# Altium schematic sheet Connector.SchDoc
size A3; SheetNumber: 1; SheetTotal: 6
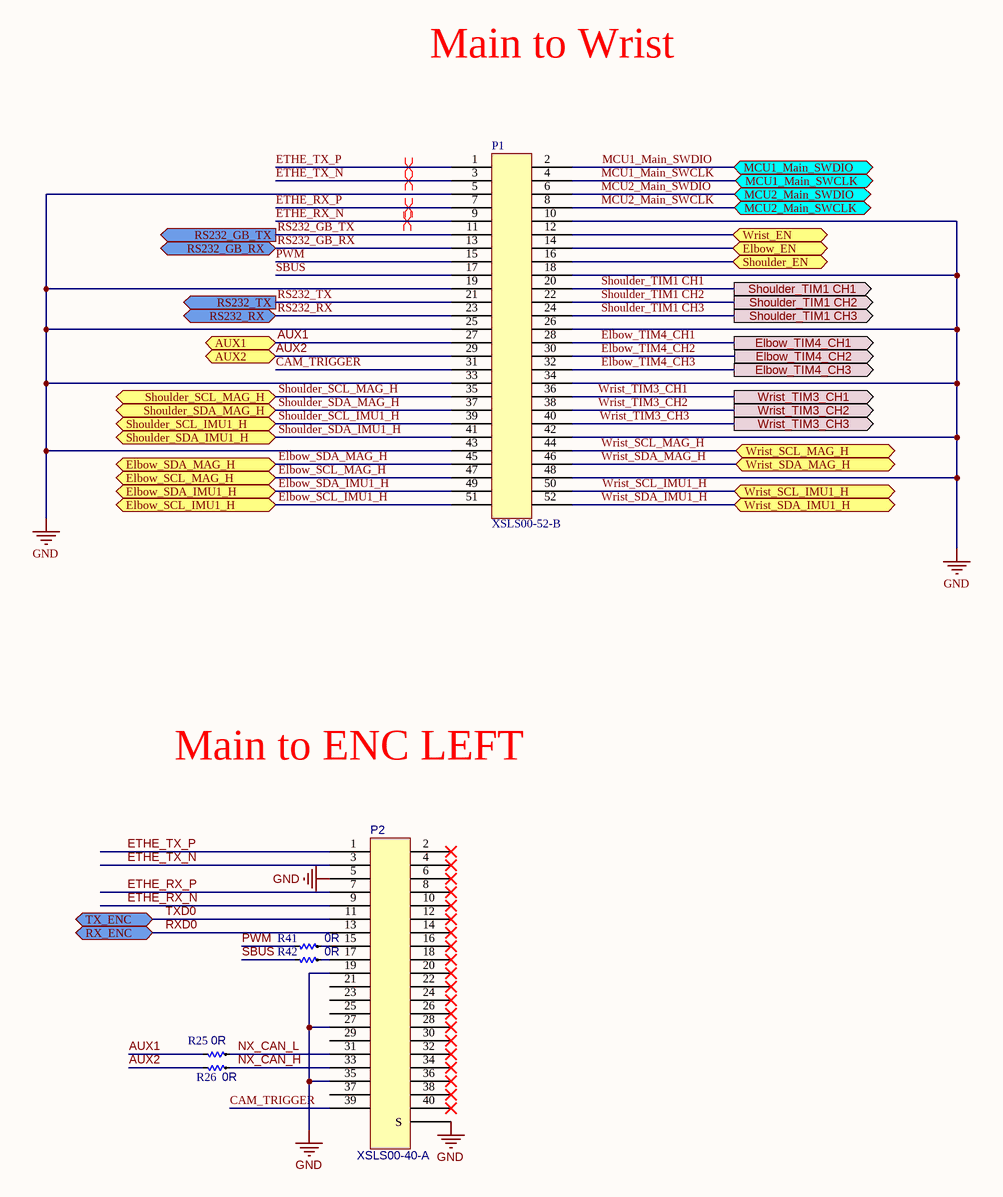
[diagram p0: Connector.SchDoc]

## Parts
P1  XSLS00-52-B  [XSXL52]
P2  XSLS00-40-A  [XSXL40]
R25  value 0R  [RES0402]  (hidden comment: RES0402 0R)  (no BOM)
R26  value 0R  [RES0402]  (hidden comment: RES0402 0R)  (no BOM)
R41  value 0R  [RES0402]  (hidden comment: RES0402 0R)
R42  value 0R  [RES0402]  (hidden comment: RES0402 0R)

## Ports
AUX1 (bidir), AUX2 (bidir), Elbow_EN (bidir), Elbow_SCL_IMU1_H (bidir), Elbow_SCL_MAG_H (bidir), Elbow_SDA_IMU1_H (bidir), Elbow_SDA_MAG_H (bidir), Elbow_TIM4_CH1 (out), Elbow_TIM4_CH2 (out), Elbow_TIM4_CH3 (out), MCU1_Main_SWCLK (bidir), MCU1_Main_SWDIO (bidir), MCU2_Main_SWCLK (bidir), MCU2_Main_SWDIO (bidir), RS232_GB_RX (bidir), RS232_GB_TX (out), RS232_RX (bidir), RS232_TX (out), RX_ENC (bidir), Shoulder_EN (bidir), Shoulder_SCL_IMU1_H (bidir), Shoulder_SCL_MAG_H (bidir), Shoulder_SDA_IMU1_H (bidir), Shoulder_SDA_MAG_H (bidir), Shoulder_TIM1 CH1 (out), Shoulder_TIM1 CH2 (out), Shoulder_TIM1 CH3 (out), TX_ENC (bidir), Wrist_EN (bidir), Wrist_SCL_IMU1_H (bidir), Wrist_SCL_MAG_H (bidir), Wrist_SDA_IMU1_H (bidir), Wrist_SDA_MAG_H (bidir), Wrist_TIM3_CH1 (out), Wrist_TIM3_CH2 (out), Wrist_TIM3_CH3 (out)

## Nets
GND: P1.5 P1.10 P1.18 P1.19 P1.25 P1.26 P1.33 P1.34 P1.42 P1.43 P1.48 P2.0(S) P2.5 P2.19 P2.27 P2.35
AUX1: P1.27 R25.1 ; port AUX1
AUX2: P1.29 R26.1 ; port AUX2
CAM_TRIGGER: P1.31 P2.39
Elbow_EN: P1.14 ; port Elbow_EN
Elbow_SCL_IMU1_H: P1.51 ; port Elbow_SCL_IMU1_H
Elbow_SCL_MAG_H: P1.47 ; port Elbow_SCL_MAG_H
Elbow_SDA_IMU1_H: P1.49 ; port Elbow_SDA_IMU1_H
Elbow_SDA_MAG_H: P1.45 ; port Elbow_SDA_MAG_H
Elbow_TIM4_CH1: P1.28 ; port Elbow_TIM4_CH1
Elbow_TIM4_CH2: P1.30 ; port Elbow_TIM4_CH2
Elbow_TIM4_CH3: P1.32 ; port Elbow_TIM4_CH3
ETHE_RX_N: P1.9 P2.9
ETHE_RX_P: P1.7 P2.7
ETHE_TX_N: P1.3 P2.3
ETHE_TX_P: P1.1 P2.1
MCU1_Main_SWCLK: P1.4 ; port MCU1_Main_SWCLK
MCU1_Main_SWDIO: P1.2 ; port MCU1_Main_SWDIO
MCU2_Main_SWCLK: P1.8 ; port MCU2_Main_SWCLK
MCU2_Main_SWDIO: P1.6 ; port MCU2_Main_SWDIO
NX_CAN_H: P2.33 R26.2
NX_CAN_L: P2.31 R25.2
PWM: P1.15 R41.1
RS232_GB_RX: P1.13 ; port RS232_GB_RX
RS232_GB_TX: P1.11 ; port RS232_GB_TX
RS232_RX: P1.23 ; port RS232_RX
RS232_TX: P1.21 ; port RS232_TX
RXD0: P2.13 ; port RX_ENC
SBUS: P1.17 R42.1
Shoulder_EN: P1.16 ; port Shoulder_EN
Shoulder_SCL_IMU1_H: P1.39 ; port Shoulder_SCL_IMU1_H
Shoulder_SCL_MAG_H: P1.35 ; port Shoulder_SCL_MAG_H
Shoulder_SDA_IMU1_H: P1.41 ; port Shoulder_SDA_IMU1_H
Shoulder_SDA_MAG_H: P1.37 ; port Shoulder_SDA_MAG_H
Shoulder_TIM1 CH1: P1.20 ; port Shoulder_TIM1 CH1
Shoulder_TIM1 CH2: P1.22 ; port Shoulder_TIM1 CH2
Shoulder_TIM1 CH3: P1.24 ; port Shoulder_TIM1 CH3
TXD0: P2.11 ; port TX_ENC
Wrist_EN: P1.12 ; port Wrist_EN
Wrist_SCL_IMU1_H: P1.50 ; port Wrist_SCL_IMU1_H
Wrist_SCL_MAG_H: P1.44 ; port Wrist_SCL_MAG_H
Wrist_SDA_IMU1_H: P1.52 ; port Wrist_SDA_IMU1_H
Wrist_SDA_MAG_H: P1.46 ; port Wrist_SDA_MAG_H
Wrist_TIM3_CH1: P1.36 ; port Wrist_TIM3_CH1
Wrist_TIM3_CH2: P1.38 ; port Wrist_TIM3_CH2
Wrist_TIM3_CH3: P1.40 ; port Wrist_TIM3_CH3
NetP2_15: P2.15 R41.2
NetP2_17: P2.17 R42.2

Not connected (* = marked no-connect by the designer): P2 2* 4* 6* 8* 10* 12* 14* 16* 18* 20* 21 22* 23 24* 25 26* 28* 29 30* 32* 34* 36* 37 38* 40*

## Layout directives
differential pair: ETHE_RX_N, ETHE_RX_P, ETHE_TX_N, ETHE_TX_P

## Notes on the sheet
- Main to Wrist
- Main to ENC LEFT

## Library data of the parts
R25 R26 R41 R42 = RES0402 0R: RES 0R 0402; MP: RC0402JR-070RL; Power Rating: 63mW; Tolerance: 5%; Package: 0402
P2 = XSLS00-40-A: Manufacturer Part Number 1: XSLS00-40-A